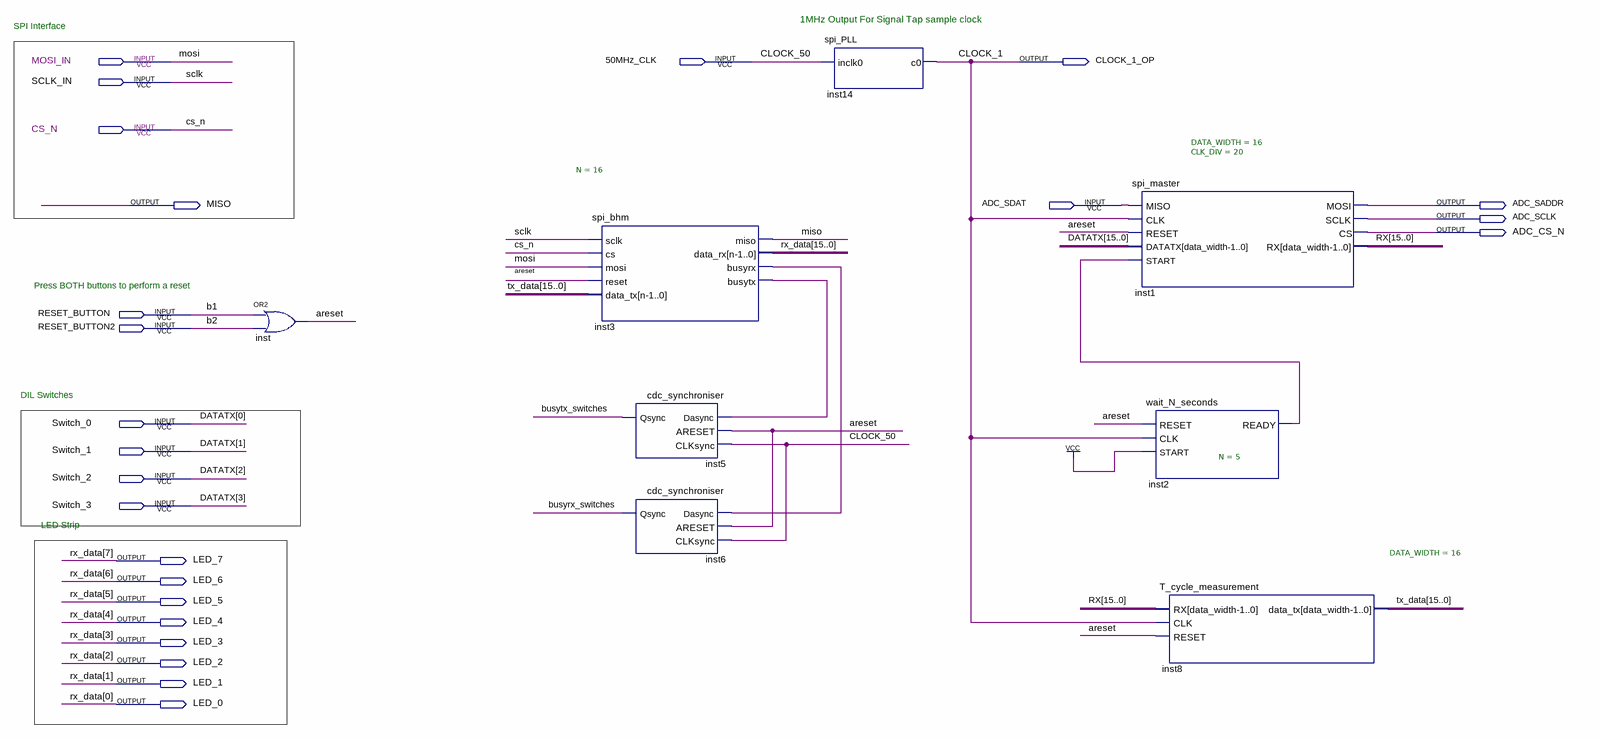
[diagram p0: schematic sheet]
// Quartus schematic spi_test.bdf as structural Verilog: 8 symbols, 24 pins
module spi_test (
  input  MOSI_IN,
  input  \50MHz_CLK ,
  input  SCLK_IN,
  input  CS_N,
  input  ADC_SDAT,
  input  RESET_BUTTON,
  input  RESET_BUTTON2,
  input  Switch_0,
  input  Switch_1,
  input  Switch_2,
  input  Switch_3,
  output CLOCK_1_OP,
  output MISO,
  output ADC_SADDR,
  output ADC_SCLK,
  output ADC_CS_N,
  output LED_7,
  output LED_6,
  output LED_5,
  output LED_4,
  output LED_3,
  output LED_2,
  output LED_1,
  output LED_0
);

  wire areset, busyrx_switches, busytx_switches, inst2_ready, inst3_busyrx, inst3_busytx;
  wire [15:0] RX, tx_data;
  wire [15:4] DATATX;
  wire [15:8] rx_data;

  or inst (areset, RESET_BUTTON, RESET_BUTTON2);
  spi_bhm #(.N(16)) inst3 (
    .sclk(SCLK_IN), .cs(CS_N), .mosi(MOSI_IN), .reset(areset), .data_tx(tx_data), .miso(MISO),
    .data_rx({rx_data, LED_7, LED_6, LED_5, LED_4, LED_3, LED_2, LED_1, LED_0}), .busyrx(inst3_busyrx),
    .busytx(inst3_busytx));
  cdc_synchroniser inst5 (.Dasync(inst3_busytx), .ARESET(areset), .CLKsync(\50MHz_CLK ), .Qsync(busytx_switches));
  cdc_synchroniser inst6 (.Dasync(inst3_busyrx), .ARESET(areset), .CLKsync(\50MHz_CLK ), .Qsync(busyrx_switches));
  spi_PLL inst14 (.inclk0(\50MHz_CLK ), .c0(CLOCK_1_OP));
  spi_master #(.DATA_WIDTH(16), .CLK_DIV(20)) inst1 (
    .MISO(ADC_SDAT), .CLK(CLOCK_1_OP), .RESET(areset),
    .DATATX({DATATX, Switch_3, Switch_2, Switch_1, Switch_0}), .START(inst2_ready), .MOSI(ADC_SADDR),
    .SCLK(ADC_SCLK), .CS(ADC_CS_N), .RX(RX));
  wait_N_seconds #(.N(5)) inst2 (.RESET(areset), .CLK(CLOCK_1_OP), .START(1'b1), .READY(inst2_ready));
  T_cycle_measurement #(.DATA_WIDTH(16)) inst8 (.RX(RX), .CLK(CLOCK_1_OP), .RESET(areset), .data_tx(tx_data));

  // Other names for the same wires on the sheet: b1 = RESET_BUTTON; b2 = RESET_BUTTON2; CLOCK_1 = CLOCK_1_OP;
  //   CLOCK_50 = \50MHz_CLK ; DATATX[3:0] = {Switch_3, Switch_2, Switch_1, Switch_0}; mosi = MOSI_IN;
  //   rx_data[7:0] = {LED_7, LED_6, LED_5, LED_4, LED_3, LED_2, LED_1, LED_0}; sclk = SCLK_IN

  // Notes on the sheet:
  //   1MHz Output For Signal Tap sample clock
  //   SPI Interface
  //   Press BOTH buttons to perform a reset
  //   DIL Switches
  //   LED Strip
endmodule
